# EAGLE design interface_dac_sma_feedback_3PS (EAGLE 7.2.0)
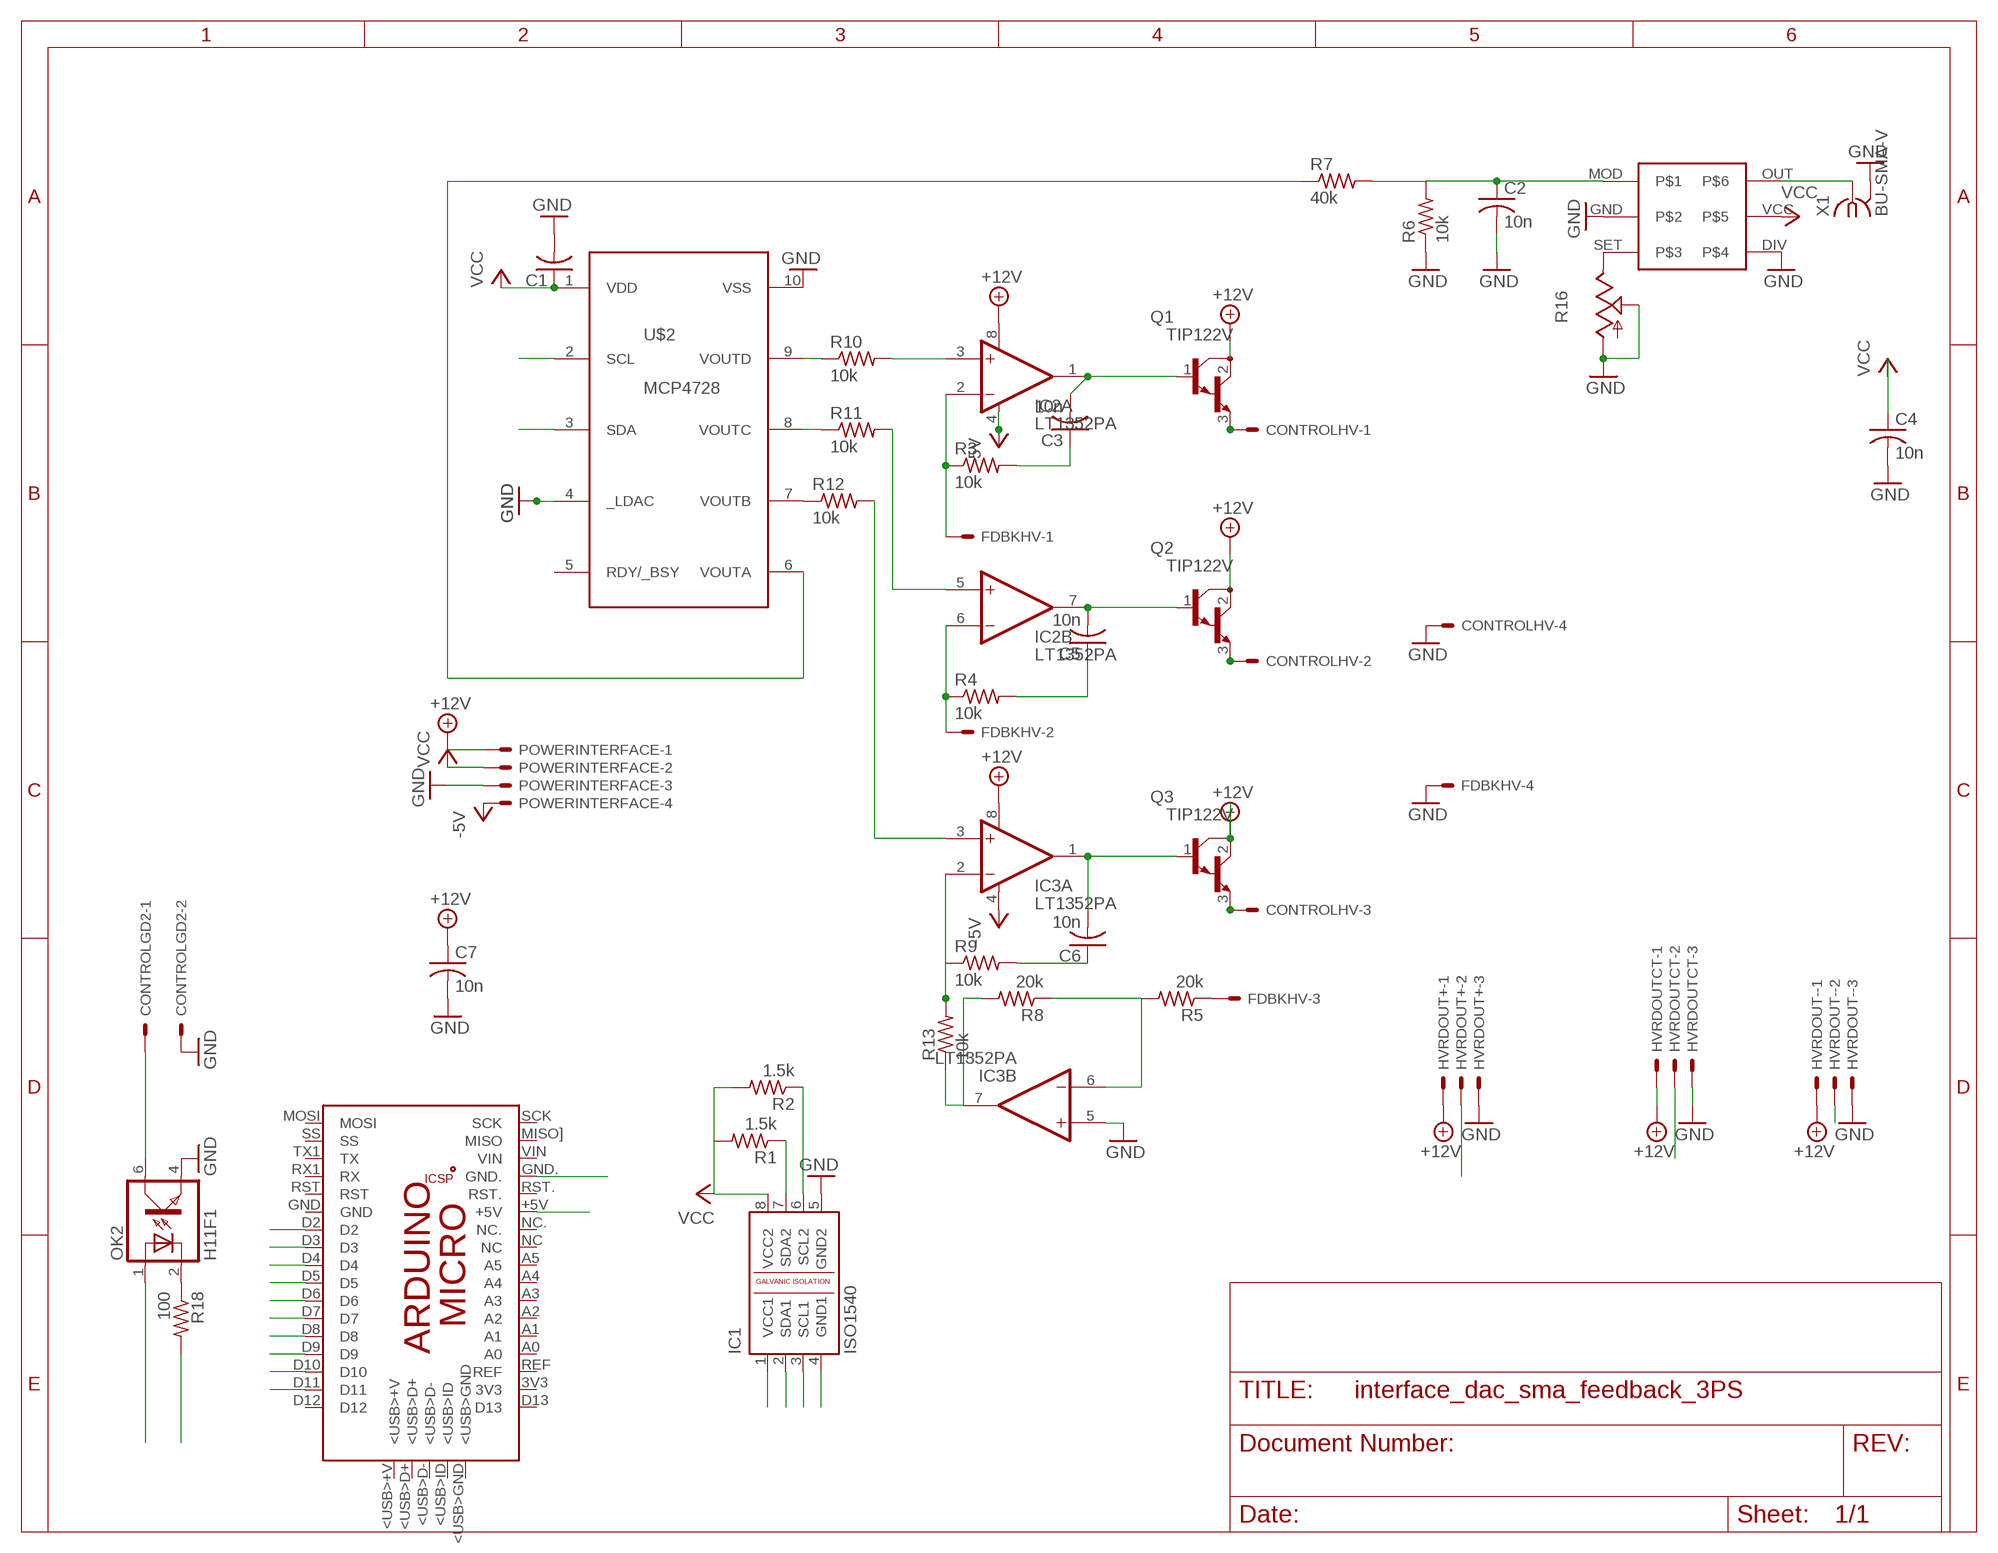
[diagram p0: schematic, sheet 1]

## Parts
C1  C-US050-050X075  [C050-050X075]
C2  10n  C-US050-024X044  [C050-024X044]
C3  10n  C-US050-024X044  [C050-024X044]
C4  10n  C-US075-063X106  [C075-063X106]
C5  10n  C-US050-024X044  [C050-024X044]
C6  10n  C-US050-024X044  [C050-024X044]
C7  10n  C-US050-050X075  [C050-050X075]
CONTROLGD2  KK-156-2  [KK-156-2]
CONTROLHV  KK-156-4  [KK-156-4]
FDBKHV  KK-156-4  [KK-156-4]
HVRDOUT+  KK-156-3  [KK-156-3]
HVRDOUT-  KK-156-3  [KK-156-3]
HVRDOUTCT  KK-156-3  [KK-156-3]
IC1  ISO1540  [DIL08]
IC2  LT1352PA  [DIL08]
IC3  LT1352PA  [DIL08]
OK2  H11F1  [DIL05]
PCB1  ARDUINO_MICRO  [ARDUINO_MICRO]
POWERINTERFACE  KK-156-4  [KK-156-4]
Q1  TIP122V  [TO220V]
Q2  TIP122V  [TO220V]
Q3  TIP122V  [TO220V]
R1  1.5k  R-US_0207/12  [0207/12]
R2  1.5k  R-US_0207/12  [0207/12]
R3  10k  R-US_0207/12  [0207/12]
R4  10k  R-US_0207/12  [0207/12]
R5  20k  R-US_0207/12  [0207/12]
R6  10k  R-US_0207/12  [0207/12]
R7  40k  R-US_0207/12  [0207/12]
R8  20k  R-US_0207/12  [0207/12]
R9  10k  R-US_0207/12  [0207/12]
R10  10k  R-US_0207/12  [0207/12]
R11  10k  R-US_0207/12  [0207/12]
R12  10k  R-US_0207/12  [0207/12]
R13  10k  R-US_0207/12  [0207/12]
R16  TRIM_US-B90P  [SP19L]
R18  100  R-US_0207/12  [0207/12]
U$1  LTC6992  [DIL06]
U$2  MCP4728DIL  [DIL10]
X1  BU-SMA-V  [BU-SMA-V]

## Nets
+12V: C7.1 HVRDOUT+.1 HVRDOUT-.1 HVRDOUTCT.1 IC2.8(A:V+) IC3.8(A:V+) POWERINTERFACE.1 Q1.2(C) Q2.2(C) Q3.2(C)
-5V: IC2.4(A:V-) IC3.4(A:V-) POWERINTERFACE.4
A+5: IC1.1(VCC1) PCB1.+5V
AGND: IC1.4(GND1) PCB1.GND. R18.2
D4: PCB1.D4
D7: PCB1.D7
D8: PCB1.D8
D10: PCB1.D10
D11: PCB1.D11
ENSW2: CONTROLGD2.1 OK2.6(COL)
GND: C1.2 C2.2 C4.2 C7.2 CONTROLGD2.2 CONTROLHV.4 FDBKHV.4 HVRDOUT+.3 HVRDOUT-.3 HVRDOUTCT.3 IC1.5(GND2) IC3.5(B:+IN) OK2.4(EMIT) POWERINTERFACE.3 R6.1 R16.A R16.S U$1.DIV U$1.GND U$2.4(_LDAC) U$2.10(VSS) X1.2 X1.3 X1.4 X1.5
N$1: R7.1 U$2.6(VOUTA)
N$2: C2.1 R6.2 R7.2 U$1.MOD
N$3: C3.1 R3.2
N$4: CONTROLHV.1 Q1.3(E)
N$5: CONTROLHV.3 Q3.3(E)
N$6: FDBKHV.2 HVRDOUTCT.2 IC2.6(B:-IN) R4.1
N$7: OK2.2(C) R18.1
N$8: FDBKHV.1 HVRDOUT+.2 IC2.2(A:-IN) R3.1
N$9: FDBKHV.3 R5.1
N$10: C5.2 IC2.7(B:OUT) Q2.1(B)
N$11: CONTROLHV.2 Q2.3(E)
N$12: R16.E U$1.SET
N$13: U$1.OUT X1.1
N$14: HVRDOUT-.2 IC3.7(B:OUT) R8.2 R13.1
N$15: C5.1 R4.2
N$16: IC2.3(A:+IN) R10.2
N$17: IC2.5(B:+IN) R11.2
N$18: IC3.3(A:+IN) R12.2
N$19: C3.2 IC2.1(A:OUT) Q1.1(B)
N$20: C6.1 R9.2
N$21: C6.2 IC3.1(A:OUT) Q3.1(B)
N$23: IC3.6(B:-IN) R5.2 R8.1
N$24: R10.1 U$2.9(VOUTD)
N$25: R12.1 U$2.7(VOUTB)
N$26: R11.1 U$2.8(VOUTC)
N$27: IC3.2(A:-IN) R9.1 R13.2
PWM5: PCB1.D5
PWM6: PCB1.D6
PWM9: OK2.1(A) PCB1.D9
SCL: IC1.3(SCL1) PCB1.D3
SCL_OUT: IC1.6(SCL2) R2.1 U$2.2(SCL)
SDA: IC1.2(SDA1) PCB1.D2
SDA_OUT: IC1.7(SDA2) R1.1 U$2.3(SDA)
VCC: C1.1 C4.1 IC1.8(VCC2) POWERINTERFACE.2 R1.2 R2.2 U$1.VCC U$2.1(VDD)
Unconnected: PCB1.3V3 PCB1.5V PCB1.<USB>+V PCB1.<USB>D+ PCB1.<USB>D- PCB1.<USB>GND PCB1.<USB>ID PCB1.A0 PCB1.A1 PCB1.A2 PCB1.A3 PCB1.A4 PCB1.A5 PCB1.D12 PCB1.D13 PCB1.GND PCB1.GND_ PCB1.MISO. PCB1.MISO](MISO) PCB1.MOSI PCB1.MOSI. PCB1.NC PCB1.NC. PCB1.REF PCB1.RESET.. PCB1.RST PCB1.RST. PCB1.RX1(RX) PCB1.SCK PCB1.SCK. PCB1.SS PCB1.TX1(TX) PCB1.VIN U$2.5(RDY/_BSY)

## Library data of the parts
C1 = rcl:C-US: CAPACITOR, American symbol
C2-C7 = resistor:C-US: CAPACITOR, American symbol
CONTROLGD2 = con-molex:KK-156-2: KK 156 HEADER Source: http://www.molex.com/pdm_docs/sd/026604100_sd.pdf; OC_FARNELL: unknown; OC_NEWARK: unknown
CONTROLHV FDBKHV POWERINTERFACE = con-molex:KK-156-4: KK 156 HEADER Source: http://www.molex.com/pdm_docs/sd/026604100_sd.pdf; OC_FARNELL: unknown; OC_NEWARK: unknown
HVRDOUT+ HVRDOUT- HVRDOUTCT = con-molex:KK-156-3: KK 156 HEADER Source: http://www.molex.com/pdm_docs/sd/026604100_sd.pdf; OC_FARNELL: unknown; OC_NEWARK: unknown
IC1 = texas:ISO1540: ISOLATED CAN TRANSCEIVER Source: http://focus.ti.com/lit/ds/symlink/iso1050.pdf
IC2 IC3 = linear-technology:LT1352: Dual Operational Amplifiers Source: http://datasheets.maxim-ic.com/en/ds/ICL7612-ICL764X.pdf; OC_FARNELL: unknown; OC_NEWARK: unknown
OK2 = optocoupler:H11F1: OPTO COUPLER OPTO COUPLER; OC_FARNELL: unknown; OC_NEWARK: unknown
PCB1 = E14_Arduino_published:ARDUINO_MICRO: Device for representing an Arduino Micro board with a footprint in an EAGLE design. Created by Dave Young for Element14. More EAGLE documentation at: http://www.element14.com/community/community/knode/cadsoft_eagle
Q1-Q3 = transistor-npn:TIP122*: NPN Darlington Transistor
R1-R13 = resistor:R-US_: RESISTOR, American symbol
R16 = pot:TRIM_US-: POTENTIOMETER
R18 = rcl:R-US_: RESISTOR, American symbol
U$1 = linear-technology:LTC6992
U$2 = microchip:MCP4728
X1 = con-coax:BU-SMA-V: FEMALE SMA CONNECTOR Radiall distributor RS 112-3794; OC_FARNELL: unknown; OC_NEWARK: unknown

## Board
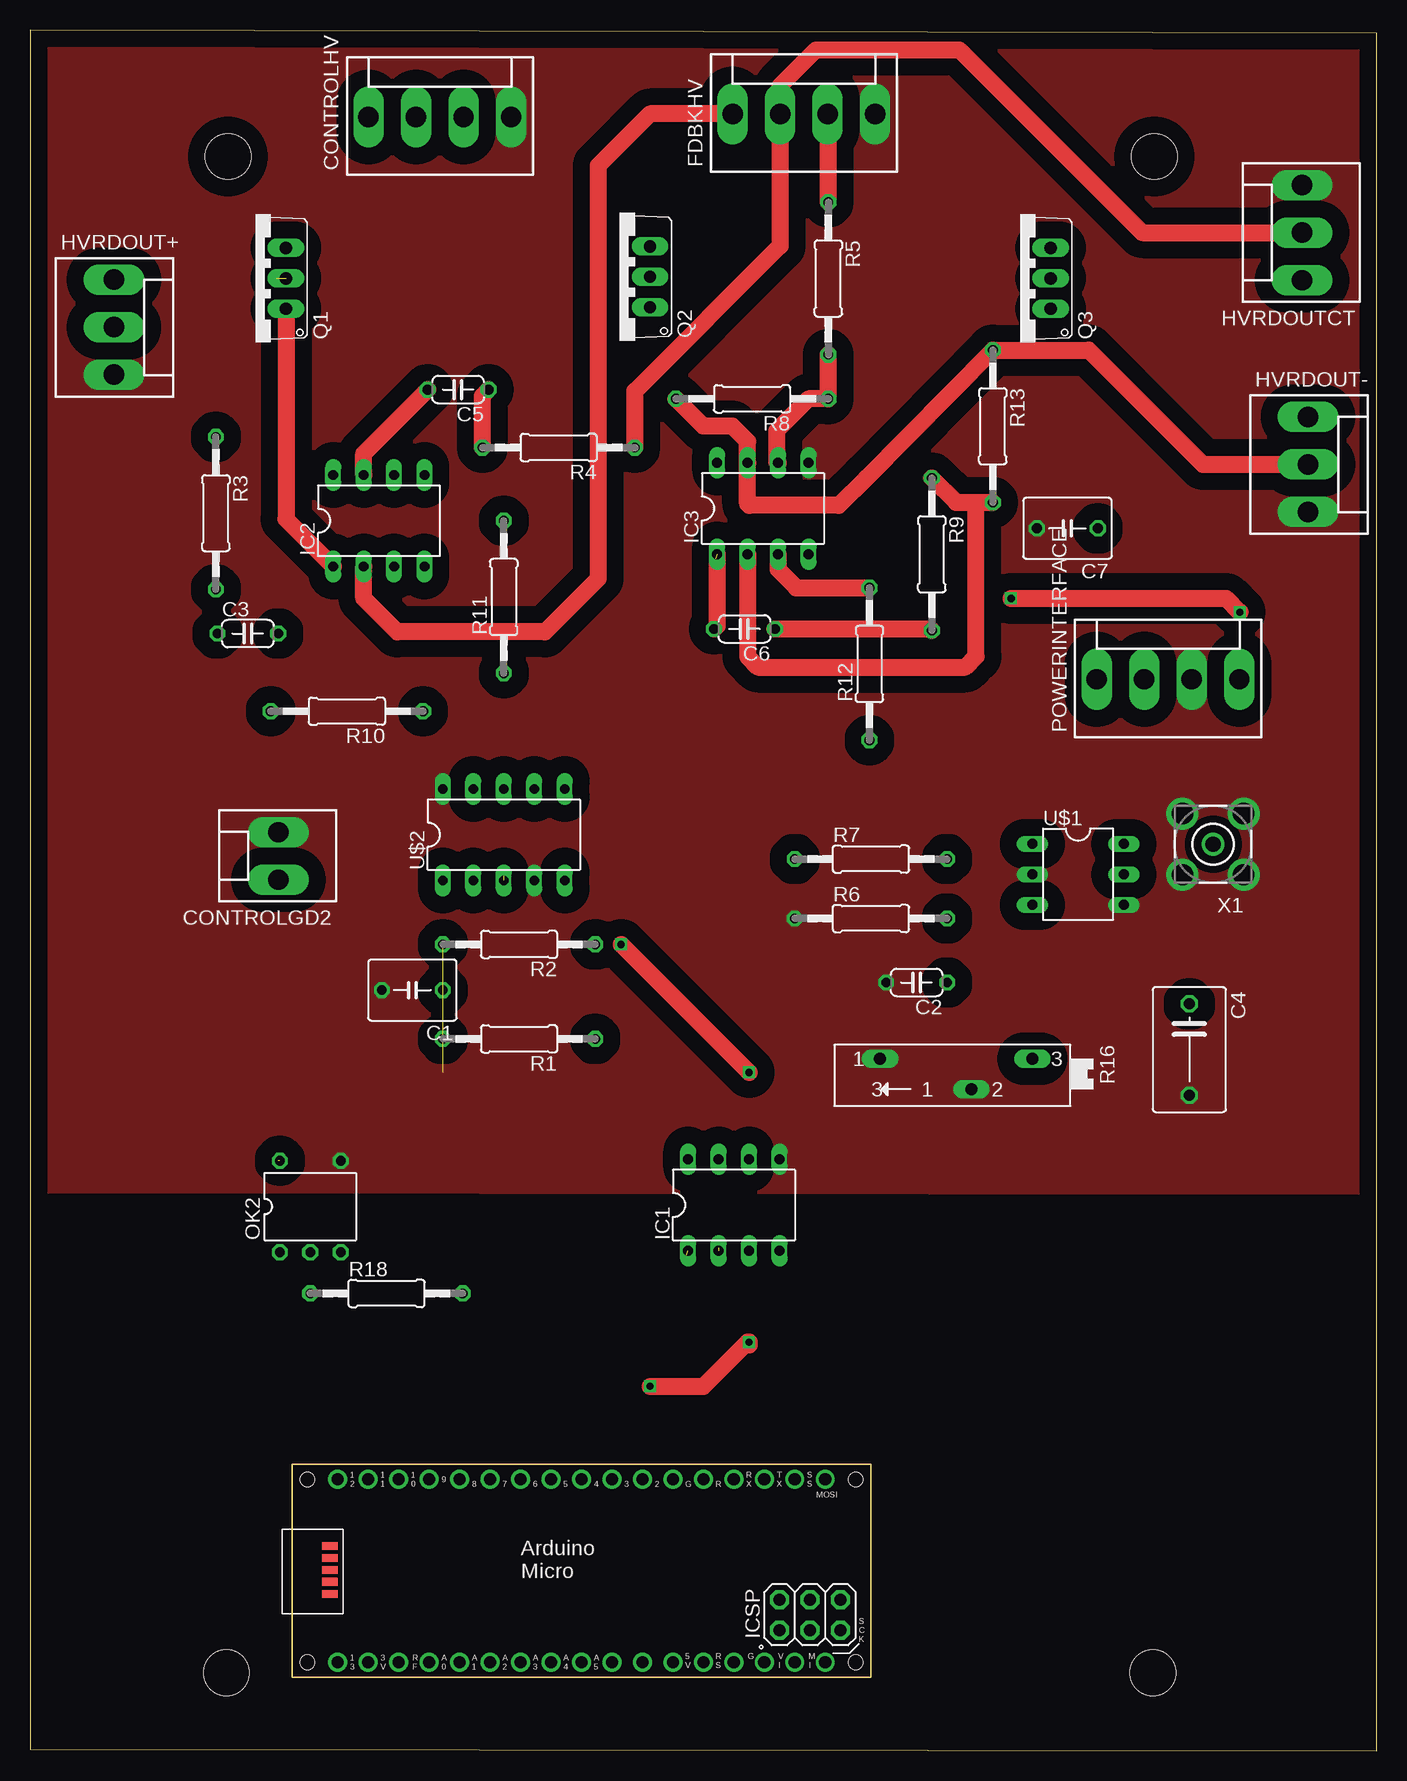
[diagram p1: board, top side]
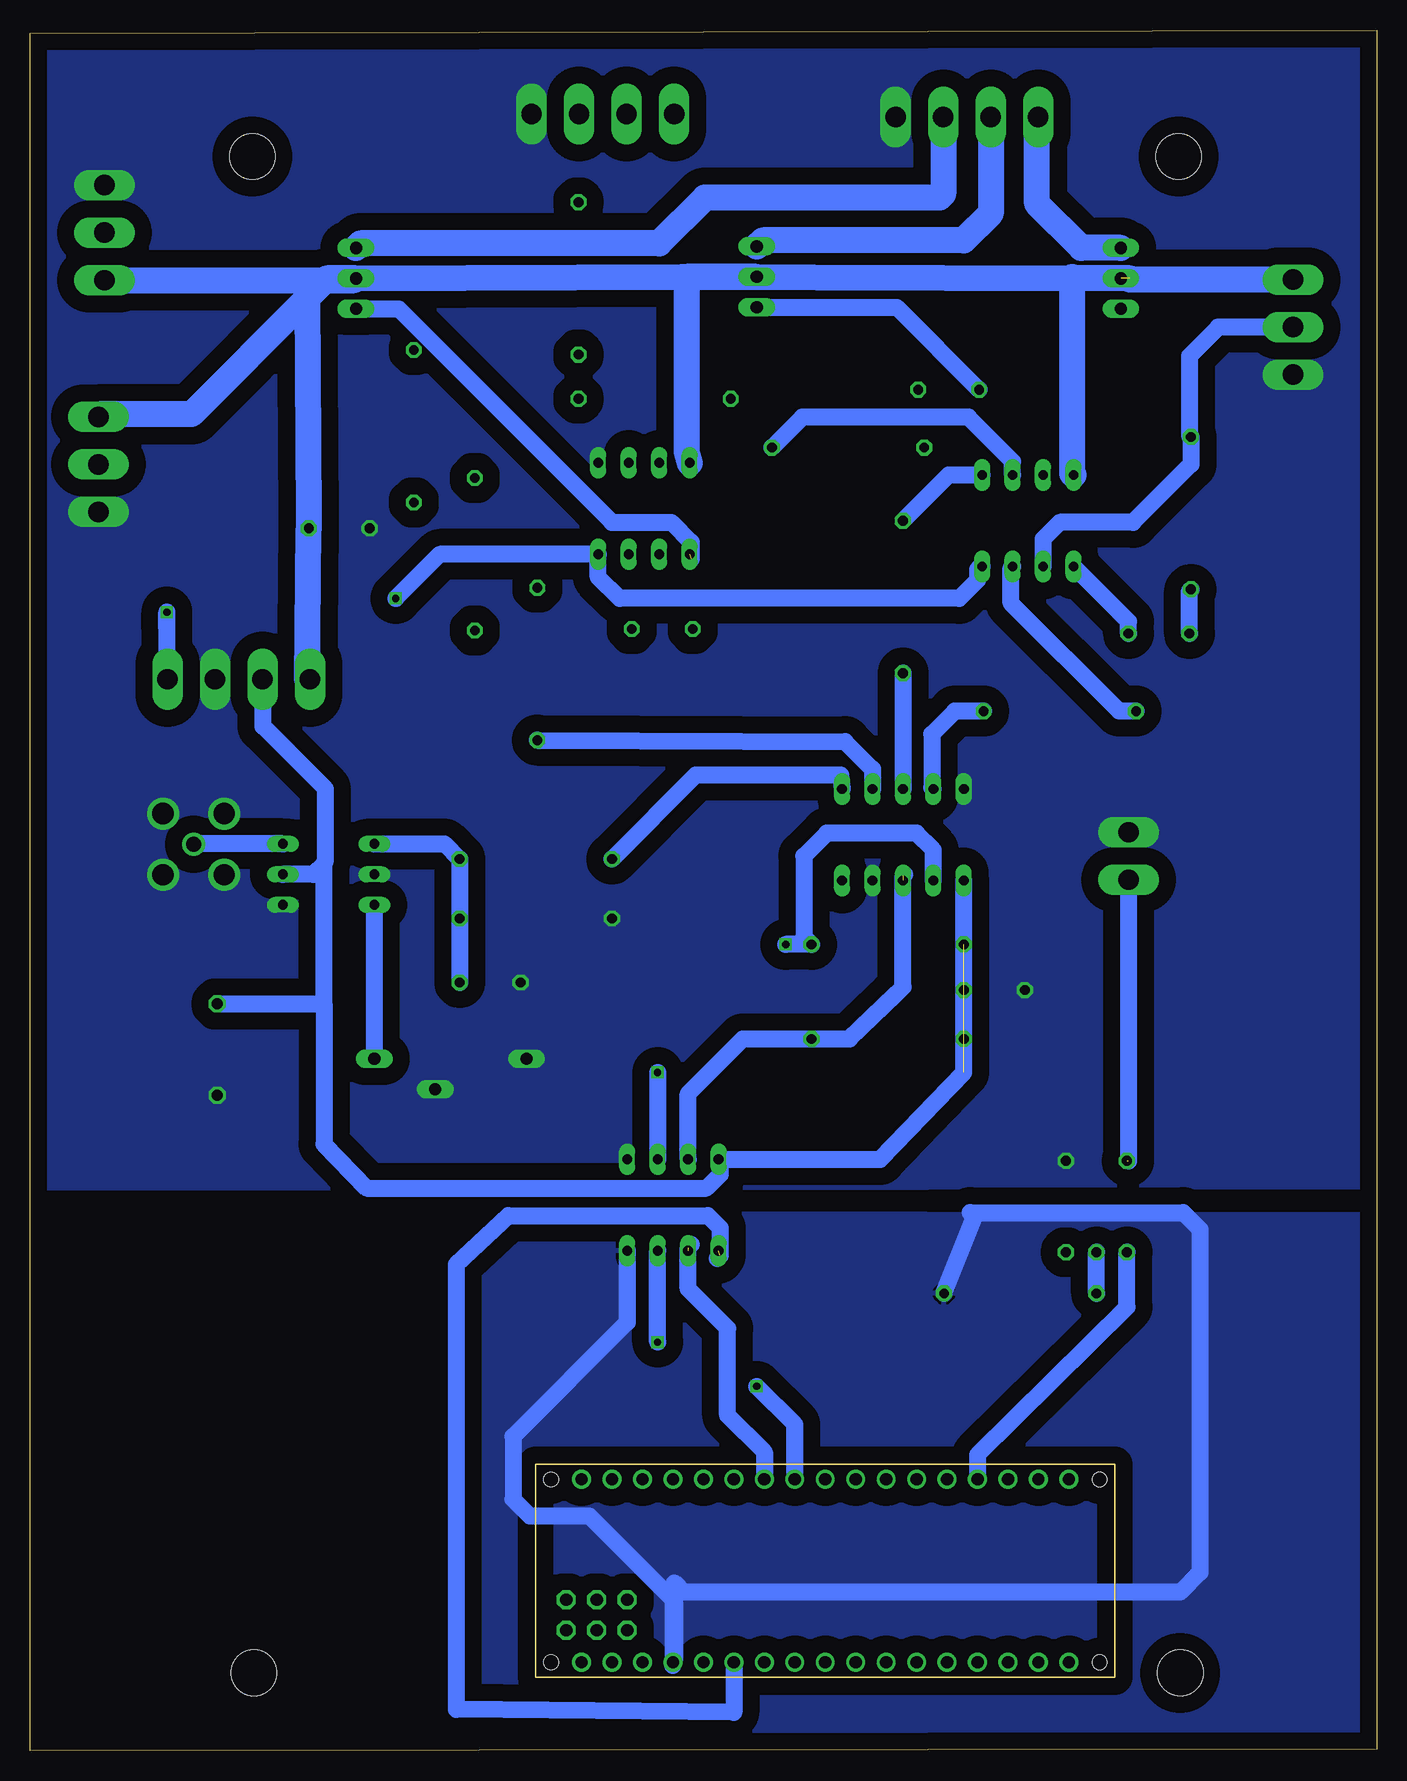
[diagram p2: board, bottom side, seen from below]

Size 112.27 x 143.38 mm. Coordinates in mm from the lower left corner, seen from the top.
Outline: 0,0.13 112.27,0 112.27,143.13 0,143.38 0,0.13
Copper layers (1*16): Top 0.035mm / dielectric 1.5mm / Bottom 0.035mm
Design rules "default *": minimum track width 56mil, minimum drill 24mil, track to track 56mil, track to pad 56mil, pad to pad 56mil, via to via 56mil, smd to smd 8mil, copper to edge 40mil, drill to drill 8mil, minimum pad ring 10mil, minimum via ring 8mil, stop-mask expansion 4mil, vias tented up to drill 0mil, thermal gap 10mil
Holes 3.8 mm at 93.6,6.48 93.73,132.84 16.51,132.84 16.38,6.48

### Footprints (pad centres in the part's own frame; a part is rotated, then mirrored left to right if it is on the bottom)
C050-050X075 = drill 0.813 octagon: 1 -2.54,0; 2 2.54,0
C050-024X044 = drill 0.813 octagon: 1 -2.54,0; 2 2.54,0
C075-063X106 = drill 0.914 octagon: 1 -3.81,0; 2 3.81,0
KK-156-2 = drill 1.7 pad 2.184 long: 1 -1.98,0; 2 1.98,0
KK-156-4 = drill 1.7 pad 2.184 long: 1 -5.94,0; 2 -1.98,0; 3 1.98,0; 4 5.94,0
KK-156-3 = drill 1.7 pad 2.184 long: 1 -3.96,0; 2 0,0; 3 3.96,0
DIL08 = drill 0.813 long: 1 -3.81,-3.81; 2 -1.27,-3.81; 3 1.27,-3.81; 4 3.81,-3.81; 5 3.81,3.81; 6 1.27,3.81; 7 -1.27,3.81; 8 -3.81,3.81
DIL05 = drill 0.813 octagon: 1 -2.54,-3.81; 2 0,-3.81; 3 2.54,-3.81; 4 2.54,3.81; 6 -2.54,3.81
ARDUINO_MICRO = drill 1.016 pad 1.575: 3V3 6.35,1.27; +5V 31.75,1.27; A0 11.43,1.27; A1 13.97,1.27; A2 16.51,1.27; A3 19.05,1.27; A4 21.59,1.27; A5 24.13,1.27; D2 29.21,16.51; D3 26.67,16.51; D4 24.13,16.51; D5 21.59,16.51; D6 19.05,16.51; D7 16.51,16.51; D8 13.97,16.51; D9 11.43,16.51; D10 8.89,16.51; D11 6.35,16.51; D12 3.81,16.51; D13 3.81,1.27; GND 31.75,16.51; GND. 36.83,1.27; MISO] 41.91,1.27; MOSI 44.45,16.51; NC 26.67,1.27; NC. 29.21,1.27; REF 8.89,1.27; RST 34.29,16.51; RST. 34.29,1.27; RX1 36.83,16.51; SCK 44.45,1.27; SS 41.91,16.51; TX1 39.37,16.51; VIN 39.37,1.27 | drill 1.016 pad 1.575 octagon: 5V 40.64,6.477; GND_ 45.72,6.477; MISO. 40.64,3.937; MOSI. 43.18,6.477; RESET.. 45.72,3.937; SCK. 43.18,3.937 | smd 1.27 x 0.635: <USB>+V 3.15,10.947; <USB>D+ 3.15,9.957; <USB>D- 3.15,8.941; <USB>GND 3.15,6.96; <USB>ID 3.15,7.976 | hole 1.2: 1.27,1.27; 1.27,16.51; 46.99,16.51; 46.99,1.27
TO220V = drill 1.016 long: 1 -2.54,-2.54; 2 0,-2.54; 3 2.54,-2.54
0207/12 = drill 0.813 octagon: 1 -6.35,0; 2 6.35,0
SP19L = drill 1.016 long: A 5.715,-1.27; E -6.985,-1.27; S -1.905,1.27
DIL06 = drill 0.813 long: DIV 2.54,3.81; GND 0,-3.81; MOD -2.54,-3.81; OUT -2.54,3.81; SET 2.54,-3.81; VCC 0,3.81
DIL10 = drill 0.813 long: 1 -5.08,-3.81; 2 -2.54,-3.81; 3 0,-3.81; 4 2.54,-3.81; 5 5.08,-3.81; 6 5.08,3.81; 7 2.54,3.81; 8 0,3.81; 9 -2.54,3.81; 10 -5.08,3.81
BU-SMA-V = drill 1.27: 1 0,0 | drill 1.778: 2 -2.55,2.55; 3 2.55,2.55; 4 2.55,-2.55; 5 -2.55,-2.55

### Placement (x,y rotation side)
C1  31.88,63.37 180 top
C2  73.91,64.01 180 top
C3  18.16,93.09 0 top
C4  96.65,58.42 270 top
C5  35.69,113.41 180 top
C6  59.56,93.47 180 top
C7  86.49,101.85 180 top
CONTROLGD2  20.7,74.55 90 top
CONTROLHV  34.16,136.14 0 top
FDBKHV  64.52,136.4 0 top
HVRDOUT+  6.98,118.62 270 top
HVRDOUT-  106.55,107.19 270 top
HVRDOUTCT  106.05,126.49 90 top
IC1  58.67,45.47 0 top
IC2  29.08,102.49 0 top
IC3  61.09,103.5 0 top
OK2  23.37,45.34 0 top
PCB1  21.84,6.1 0 top
POWERINTERFACE  94.87,89.28 0 top
Q1  18.8,122.68 90 top
Q2  49.15,122.81 90 top
Q3  82.55,122.68 90 top
R1  40.77,59.31 180 top
R2  40.77,67.18 180 top
R3  15.49,103.12 270 top
R4  44.07,108.58 180 top
R5  66.55,122.68 270 top
R6  70.1,69.34 0 top
R7  70.1,74.3 0 top
R8  60.2,112.65 180 top
R9  75.18,99.69 270 top
R10  26.42,86.61 180 top
R11  39.5,96.14 90 top
R12  69.98,90.55 90 top
R13  80.26,110.36 270 top
R16  76.58,56.39 180 top
R18  29.72,38.1 0 top
U$1  87.38,73.02 270 top
U$2  39.5,76.33 0 top
X1  98.63,75.54 180 top

### Tracks (layer width: path | path; a pad name or v marks a point on that pad's centre or on a via)
+12V  (1 unrouted)
  Bottom 2.184: POWERINTERFACE.1 89.15,89.15 C7.1 89.03,102.87 89.15,121.03 | Q3.2 57.53,122.81 | 57.53,122.81 25.27,122.68 | 89.15,121.03 87.5,122.68 Q3.2 | 25.27,122.68 20.57,122.68 20.57,122.58 HVRDOUT+.1 | 25.27,122.68 25.4,122.81 25.4,106.43 IC2.8 | Q2.2 57.53,122.81 | 57.91,122.81 57.53,122.81 | 57.53,122.81 57.53,108.2 IC3.8 | 89.15,121.03 98.81,111.38 106.32,111.38 HVRDOUT-.1 | HVRDOUTCT.1 85.24,122.53 Q3.2
-5V  (via drill 0.6)
  Top 1.422: v81.79,96.01 99.72,96.01 v100.86,94.87
  Bottom 1.422: IC2.4 33.02,98.68 33.27,98.42 33.27,97.54 34.8,96.01 63.12,96.01 64.9,97.79 IC3.4 78.11,99.69 v81.79,96.01 | POWERINTERFACE.4 v100.86,94.87 100.86,89.33 POWERINTERFACE.4
A+5  (1 unrouted)
  Bottom 1.422: PCB1.+5V 53.59,3.17 76.71,3.43 76.71,40.51 72.39,44.58 55.75,44.58 54.74,43.56 54.74,41.28 54.99,41.02
AGND
  Bottom 1.422: IC1.4 62.48,35.69 72.01,26.16 72.01,20.95 70.61,19.56 65.66,19.56 58.67,12.57 PCB1.GND. | PCB1.GND. 58.67,7.11 | R18.2 33.53,44.45 33.91,44.83 16.13,44.83 14.73,43.43 14.73,14.86 16.38,13.21 57.79,13.21 58.55,13.97 58.55,7.49 PCB1.GND.
  pour Bottom (isolate 1.422): -0.13,0.25 112.52,0.25 112.52,44.83 0,44.7
ENSW2  (1 unrouted)
  Bottom 1.422: CONTROLGD2.1 20.7,49.15
GND
  pour Bottom (isolate 1.422, no thermals): 0,143.13 112.27,143 112.27,46.86 0,46.99
  pour Top (isolate 1.422, no thermals): 0,143.26 112.39,143.13 112.39,46.48 0,46.61
N$1
  Bottom 1.422: U$2.6 44.7,81.28 56.77,81.28 R7.1
N$2
  Bottom 1.422: U$1.MOD 77.72,75.56 R7.2 R6.2 C2.1
N$3
  Bottom 1.422: C3.1 15.62,96.65 R3.2
N$4
  Bottom 2.184: Q1.3 24.64,125.22 28.32,128.91 28.32,136.05 CONTROLHV.1
N$5
  Bottom 2.184: CONTROLHV.3 36.14,129.72 36.45,129.41 56.01,129.41 59.82,125.6 84.71,125.6 Q3.3
N$6
  Top 1.422: R4.1 50.42,113.28 62.54,125.4 FDBKHV.2 62.54,138.74 65.53,141.73 77.47,141.73 92.71,126.49 HVRDOUTCT.2
  Bottom 1.422: IC2.6 30.35,107.44 34.04,111.12 47.88,111.12 R4.1
N$7
  Bottom 1.422: R18.1 OK2.2
N$8
  Top 1.422: FDBKHV.1 51.69,136.4 47.37,132.08 47.37,97.66 42.93,93.22 30.61,93.22 27.81,96.01 IC2.2
  Bottom 1.422: IC2.2 27.81,100.96 26.42,102.36 20.32,102.36 15.49,107.19 R3.1 15.62,109.6 15.62,116.2 13.21,118.62 HVRDOUT+.2
N$9
  Top 1.422: R5.1 66.55,136.35 FDBKHV.3
N$10
  Top 1.422: IC2.7 27.81,108.08 C5.2
  Bottom 1.422: Q2.1 40.01,120.27 C5.2
N$11
  Bottom 2.184: CONTROLHV.2 32.18,128.09 34.42,125.86 51.18,125.86 Q2.3
N$12
  Bottom 1.422: U$1.SET R16.E
N$13
  Bottom 1.422: U$1.OUT 98.35,75.56 X1.1
N$14
  Top 1.422: R8.2 56.13,110.36 58.55,110.36 59.82,109.09 IC3.7 59.82,103.89 59.94,103.76 67.44,103.76 69.72,106.05 R13.1 88.27,116.71 97.79,107.19 HVRDOUT-.2
N$15
  Top 1.422: R4.2 37.72,112.9 C5.1
N$16
  Bottom 1.422: R10.2 21.46,86.61 30.48,95.63 30.48,98.55 IC2.3
N$17
  Bottom 1.422: IC2.5 35.69,106.3 R11.2
N$18
  Top 1.422: IC3.3 62.36,98.42 63.88,96.9 R12.2
N$19
  Top 1.422: Q1.1 21.34,102.62 IC2.1
  Bottom 1.422: C3.2 20.7,94.11 IC2.1
N$20
  Top 1.422: C6.1 75.06,93.47 R9.2
N$21  (1 unrouted)
  Top 1.422: IC3.1 57.28,93.73 C6.2
  Bottom 1.422: Q3.1 81.53,120.14 63.75,102.36 58.8,102.36 57.15,100.71 57.15,99.31 57.28,99.19
N$23
  Top 1.422: IC3.6 62.23,107.44 62.23,109.98 64.9,112.65 R8.1 R5.2
N$24
  Bottom 1.422: R10.1 35.18,86.61 37.08,84.71 37.08,80.26 U$2.9
N$25
  Bottom 1.422: R12.1 44.32,84.07 42.04,81.79 U$2.7
N$26
  Bottom 1.422: R11.1 U$2.8
N$27
  Top 1.422: R9.1 77.22,104.01 78.87,104.01 | 78.87,104.01 R13.2 | IC3.2 59.82,91.19 60.71,90.3 77.98,90.3 78.87,91.19 78.87,104.01
PWM9
  Bottom 1.422: PCB1.D9 33.27,24.64 20.83,36.96 OK2.1
SCL  (via drill 0.6)
  Top 1.422: v51.69,30.35 56.13,30.35 59.82,34.04 59.94,33.78 v59.94,34.04
  Bottom 1.422: PCB1.D3 48.51,27.18 v51.69,30.35 | v59.94,34.04 IC1.3
SCL_OUT  (via drill 0.6)
  Top 1.422: v49.28,67.18 v59.94,56.52
  Bottom 1.422: U$2.2 36.96,75.06 38.35,76.45 45.85,76.45 47.75,74.55 47.75,67.82 R2.1 v49.28,67.18 | v59.94,56.52 IC1.6
SDA  (1 unrouted)
  Bottom 1.422: PCB1.D2 51.05,24.89 54.1,27.94 54.1,35.18 57.4,38.48 57.4,41.91 57.15,42.16
SDA_OUT  (1 unrouted)
  Bottom 1.422: IC1.7 57.4,54.74 52.83,59.31 R1.1 43.94,59.31 40.13,62.99 39.5,63.63 39.5,72.9 39.37,73.02
VCC  (3 unrouted)
  Bottom 1.422: 87.76,73.91 87.63,74.17 87.63,80.14 92.84,85.34 92.84,89.71 POWERINTERFACE.2 | 87.76,73.91 88.65,73.02 U$1.VCC | C4.1 87.76,62.23 | 87.76,62.23 87.76,73.91 | U$2.1 34.42,56.52 41.4,49.28 IC1.8 54.74,49.15 54.74,48.01 55.88,46.86 84.2,46.86 87.76,50.55 87.76,62.23